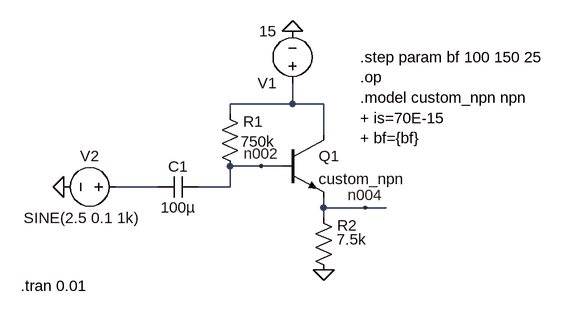
[diagram p0: schematic c02fig28.asc]
c02fig28.asc, the LTspice schematic file:
Version 4
SHEET 1 880 680
WIRE 224 160 224 128
WIRE 224 160 128 160
WIRE 272 160 224 160
WIRE 128 176 128 160
WIRE 272 208 272 160
WIRE 176 256 128 256
WIRE 208 256 176 256
WIRE 16 288 -48 288
WIRE 128 288 128 256
WIRE 128 288 80 288
WIRE 272 320 272 304
WIRE 336 320 272 320
WIRE 368 320 336 320
WIRE 272 336 272 320
FLAG 272 416 0
FLAG -128 288 0
FLAG 224 48 0
FLAG 336 320 n004
FLAG 176 256 n002
SYMBOL voltage 224 144 R180
WINDOW 123 0 0 Left 0
WINDOW 39 0 0 Left 0
SYMATTR InstName V1
SYMATTR Value 15
SYMBOL voltage -32 288 R90
WINDOW 0 -32 56 VBottom 2
WINDOW 3 63 68 VBottom 2
WINDOW 123 0 0 Left 0
WINDOW 39 0 0 Left 0
SYMATTR InstName V2
SYMATTR Value SINE(2.5 0.1 1k)
SYMBOL cap 80 272 R90
WINDOW 0 0 32 VBottom 2
WINDOW 3 32 32 VTop 2
SYMATTR InstName C1
SYMATTR Value 100µ
SYMBOL res 112 160 R0
WINDOW 0 36 27 Left 2
WINDOW 3 32 58 Left 2
SYMATTR InstName R1
SYMATTR Value 750k
SYMBOL res 256 320 R0
WINDOW 0 37 27 Left 2
WINDOW 3 36 49 Left 2
SYMATTR InstName R2
SYMATTR Value 7.5k
SYMBOL npn 208 208 R0
SYMATTR InstName Q1
SYMATTR Value custom_npn
TEXT 328 88 Left 2 !.step param bf 100 150 25\n.op\n.model custom_npn npn\n+ is=70E-15\n+ bf={bf}
TEXT -194 440 Left 2 !.tran 0.01

The netlist it stands for:
* c02fig28.asc
V1 N001 0 15
V2 N003 0 SINE(2.5 0.1 1k)
C1 n002 N003 100µ
R1 N001 n002 750k
R2 n004 0 7.5k
Q1 N001 n002 n004 0 custom_npn
.model NPN NPN
.model PNP PNP
.lib standard.bjt
.step param bf 100 150 25
.op
.model custom_npn npn
+ is=70E-15
+ bf={bf}
.tran 0.01
.backanno
.end